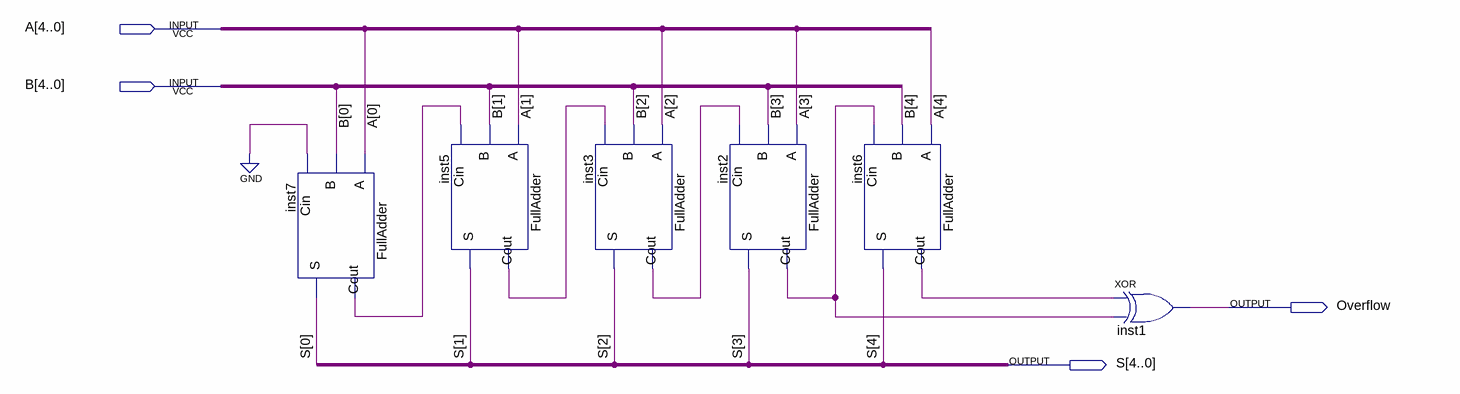
[diagram p0: schematic sheet]
// Quartus schematic FullAdder5Bits.bdf as structural Verilog: 6 symbols, 4 pins
module FullAdder5Bits (
  input  [4:0] A,
  input  [4:0] B,
  output Overflow,
  output [4:0] S
);

  wire inst2_cout, inst3_cout, inst5_cout, inst6_cout, inst7_cout;

  FullAdder inst7 (.A(A[0]), .B(B[0]), .Cin(1'b0), .S(S[0]), .Cout(inst7_cout));
  FullAdder inst5 (.A(A[1]), .B(B[1]), .Cin(inst7_cout), .S(S[1]), .Cout(inst5_cout));
  FullAdder inst3 (.A(A[2]), .B(B[2]), .Cin(inst5_cout), .S(S[2]), .Cout(inst3_cout));
  FullAdder inst2 (.A(A[3]), .B(B[3]), .Cin(inst3_cout), .S(S[3]), .Cout(inst2_cout));
  FullAdder inst6 (.A(A[4]), .B(B[4]), .Cin(inst2_cout), .S(S[4]), .Cout(inst6_cout));
  xor inst1 (Overflow, inst6_cout, inst2_cout);
endmodule
